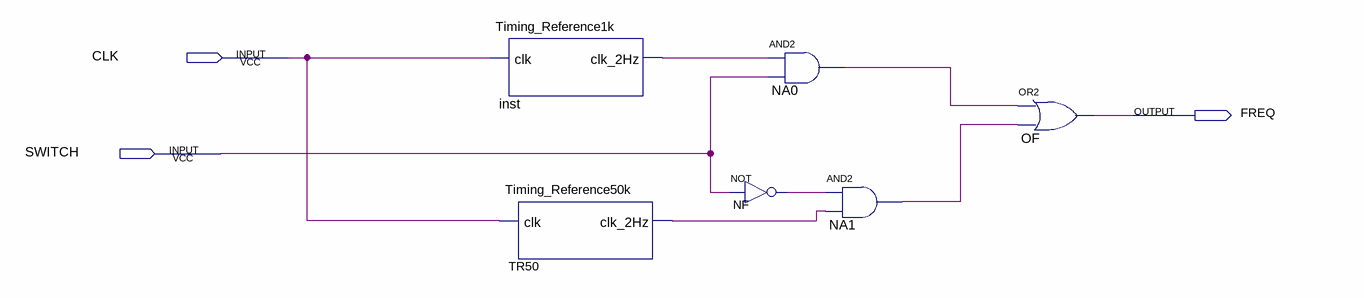
[diagram p0: schematic sheet]
// Quartus schematic frequence.bdf as structural Verilog: 6 symbols, 3 pins
module frequence (
  input  CLK,
  input  SWITCH,
  output FREQ
);

  wire inst_clk_2hz, NA0_out, NA1_out, NF_out, TR50_clk_2hz;

  Timing_Reference1k inst (.clk(CLK), .clk_2Hz(inst_clk_2hz));
  Timing_Reference50k TR50 (.clk(CLK), .clk_2Hz(TR50_clk_2hz));
  not NF (NF_out, SWITCH);
  and NA0 (NA0_out, inst_clk_2hz, SWITCH);
  and NA1 (NA1_out, NF_out, TR50_clk_2hz);
  or OF (FREQ, NA0_out, NA1_out);
endmodule
